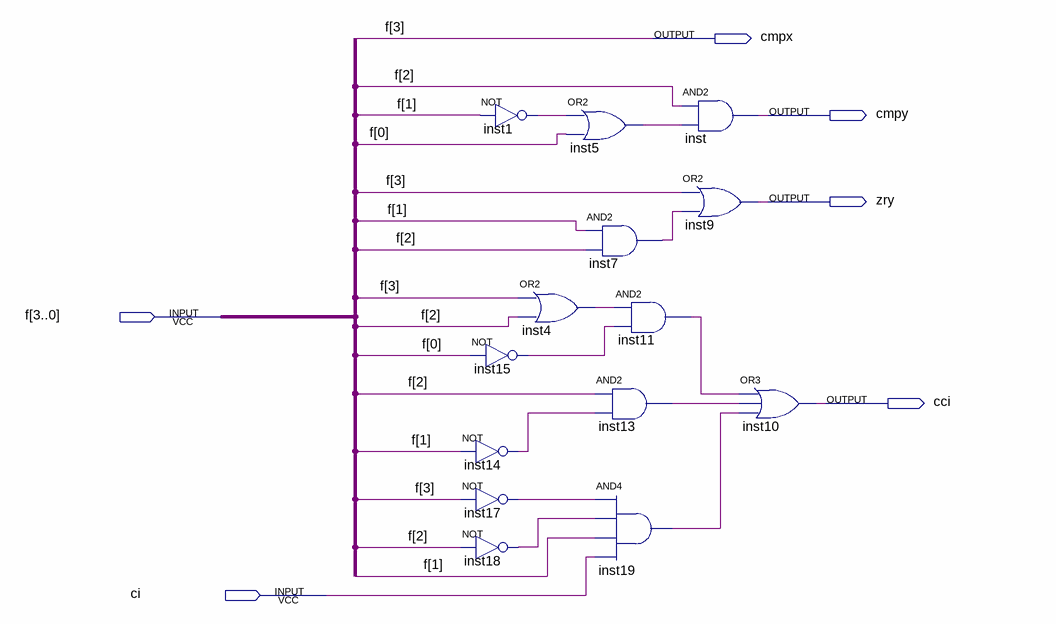
[diagram p0: schematic sheet]
// Quartus schematic decodificador_ULA.bdf as structural Verilog: 14 symbols, 6 pins
module decodificador_ULA (
  input  [3:0] f,
  input  ci,
  output cmpx,
  output cmpy,
  output zry,
  output cci
);

  wire inst1_out, inst4_out, inst5_out, inst7_out, inst11_out, inst13_out, inst14_out, inst15_out,
       inst17_out, inst18_out, inst19_out;

  not inst1 (inst1_out, f[1]);
  or inst4 (inst4_out, f[3], f[2]);
  not inst15 (inst15_out, f[0]);
  not inst14 (inst14_out, f[1]);
  not inst17 (inst17_out, f[3]);
  not inst18 (inst18_out, f[2]);
  or inst5 (inst5_out, inst1_out, f[0]);
  and inst7 (inst7_out, f[1], f[2]);
  and inst13 (inst13_out, f[2], inst14_out);
  and inst19 (inst19_out, inst17_out, inst18_out, f[1], ci);
  and inst (cmpy, f[2], inst5_out);
  or inst9 (zry, f[3], inst7_out);
  and inst11 (inst11_out, inst4_out, inst15_out);
  or inst10 (cci, inst11_out, inst13_out, inst19_out);

  assign cmpx = f[3];
endmodule
